# EAGLE design RCV420_RevA (EAGLE 7.4.0)
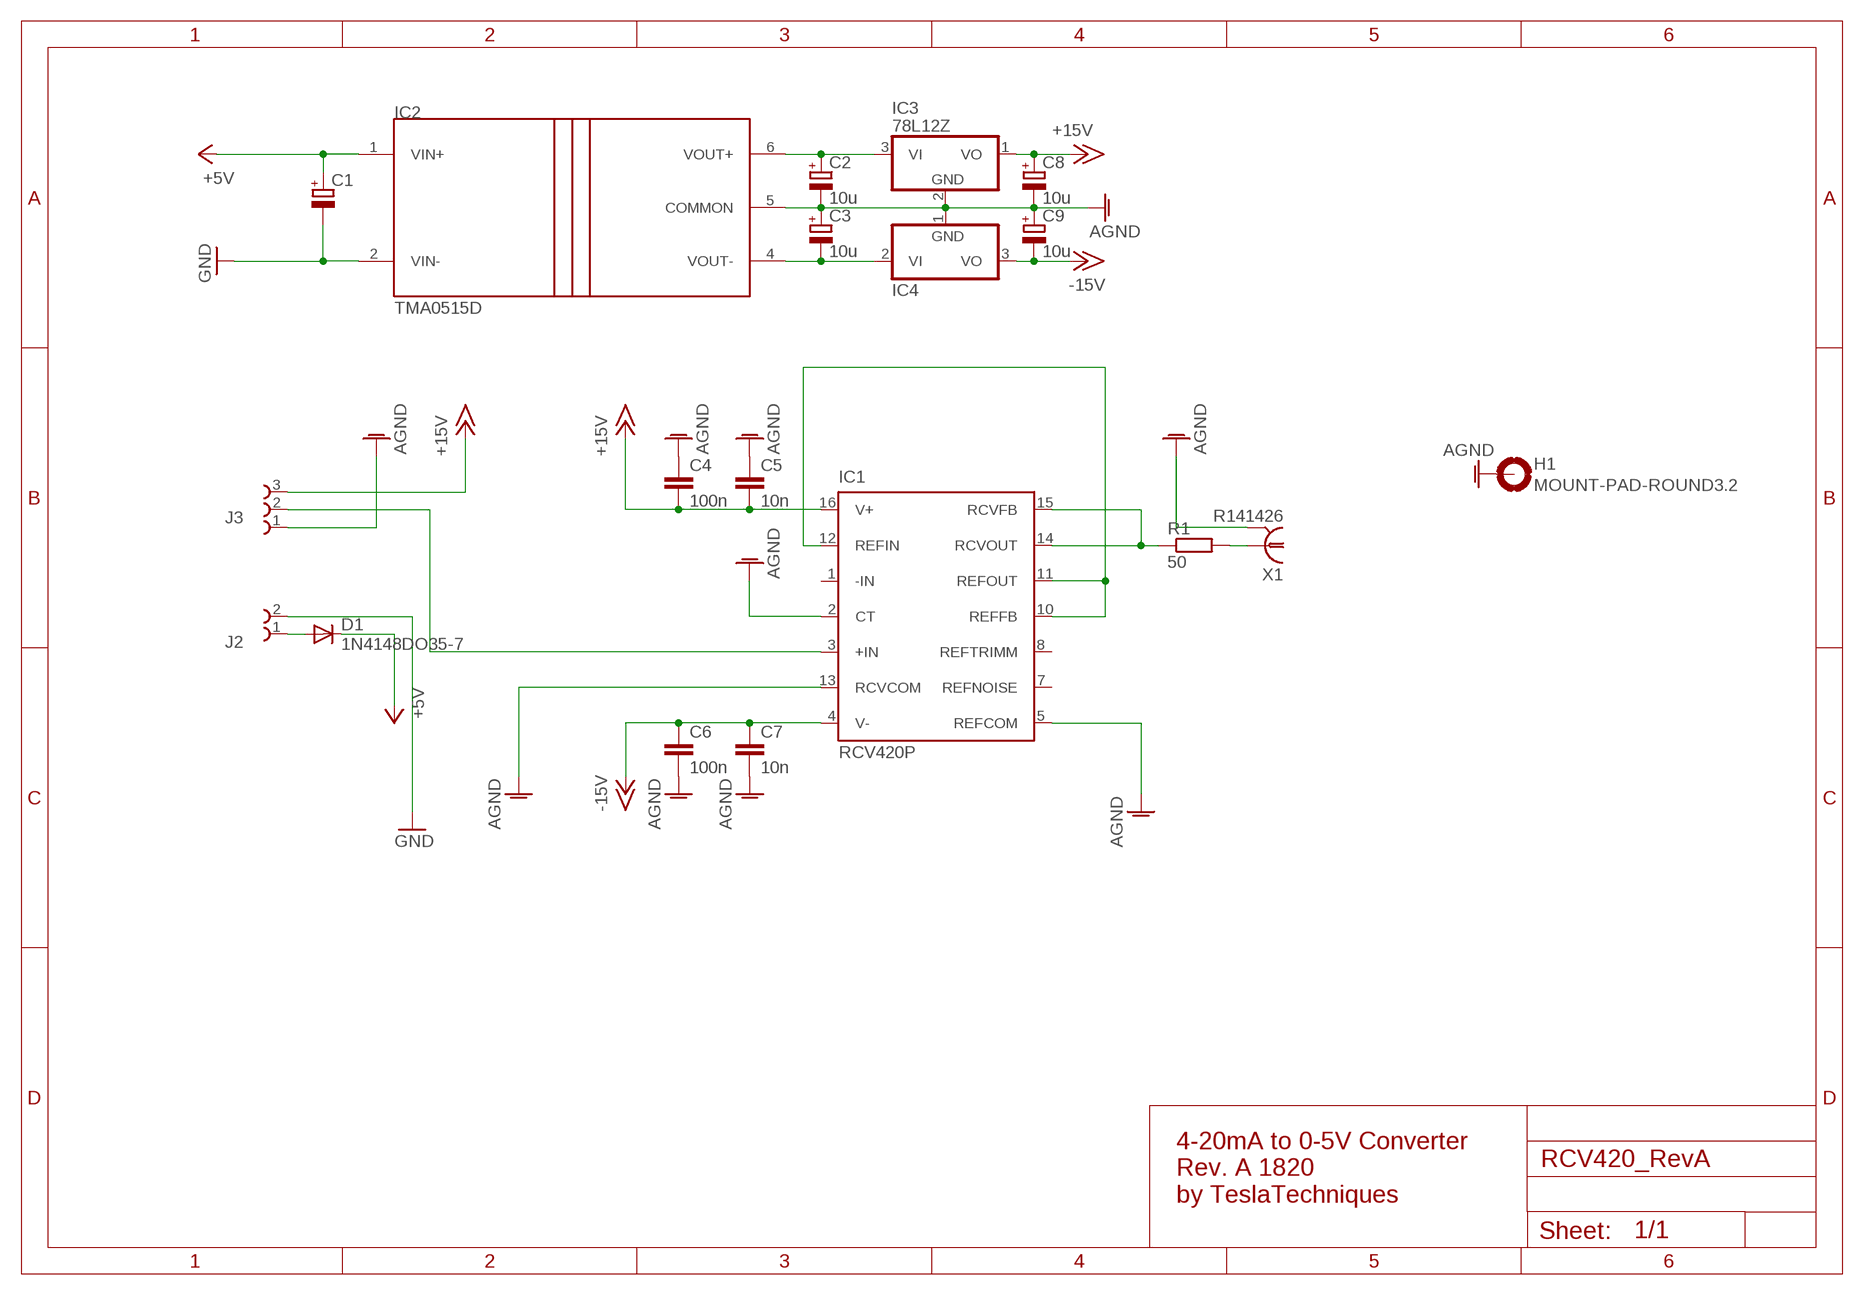
[diagram p0: schematic, sheet 1]

## Parts
C1  CPOL-EUE2.5-5  [E2,5-5]
C2  10u  CPOL-EUE2.5-5  [E2,5-5]
C3  10u  CPOL-EUE2.5-5  [E2,5-5]
C4  100n  C-EU025-025X050  [C025-025X050]
C5  10n  C-EU025-025X050  [C025-025X050]
C6  100n  C-EU025-025X050  [C025-025X050]
C7  10n  C-EU025-025X050  [C025-025X050]
C8  10u  CPOL-EUE2.5-5  [E2,5-5]
C9  10u  CPOL-EUE2.5-5  [E2,5-5]
D1  1N4148DO35-7  [DO35-7]
H1  MOUNT-PAD-ROUND3.2  [3,2-PAD]
IC1  RCV420P  [DIL16]
IC2  TMA0515D  [SIP7]
IC3  78L12Z  [TO92]
IC4  7912L  [TO92]
J2  691111710002  [691111710002]
J3  691111710003  [691111710003]
R1  50  R-EU_0411/12  [0411/12]
X1  R141426  [R141426]

## Nets
+5V: C1.+ D1.C IC2.1(VIN+)
+15V: C4.2 C5.2 C8.+ IC1.16(V+) IC3.1(VO) J3.3
-15V: C6.1 C7.1 C9.- IC1.4(V-) IC4.3(VO)
AGND: C2.- C3.+ C4.1 C5.1 C6.2 C7.2 C8.- C9.+ H1.B3,2(MOUNT) IC1.2(CT) IC1.5(REFCOM) IC1.13(RCVCOM) IC2.5(COMMON) IC3.2(GND) IC4.1(GND) J3.1 X1.2 X1.3 X1.4 X1.5
GND: C1.- IC2.2(VIN-) J2.2
N$1: IC1.3(+IN) J3.2
N$2: C2.+ IC2.6(VOUT+) IC3.3(VI)
N$3: C3.- IC2.4(VOUT-) IC4.2(VI)
N$4: D1.A J2.1
N$9: IC1.14(RCVOUT) IC1.15(RCVFB) R1.1
N$11: IC1.10(REFFB) IC1.11(REFOUT) IC1.12(REFIN)
N$13: R1.2 X1.1
Unconnected: IC1.1(-IN) IC1.7(REFNOISE) IC1.8(REFTRIMM)

## Notes on the sheet
- 4-20mA to 0-5V Converter
  Rev. A 1820
  by TeslaTechniques

## Library data of the parts
C1-C3 C8 C9 = rcl:CPOL-EU: POLARIZED CAPACITOR, European symbol
C4-C7 = rcl:C-EU: CAPACITOR, European symbol
D1 = diode:1N4148: DIODE high speed (Philips)
H1 = holes:MOUNT-PAD-ROUND: MOUNTING PAD, round
IC1 = burr-brown:RCV420: Precision 4mA to 20mA CURRENT LOOP RECEIVER Source: http://focus.ti.com/lit/ds/symlink/rcv420.pdf; MF: TEXAS INSTRUMENTS; MPN: RCV420JP; OC_FARNELL: 1212342; OC_NEWARK: 60K6765
IC2 = traco_tma:TMA: Traco Power TMA Series DC/DC Converter
IC3 = linear:78*: Positive VOLTAGE REGULATOR Source: http://cache.national.com/ds/LM/LM78L05.pdf http://www.fairchildsemi.com/ds/LM/LM7805.pdf
IC4 = linear:79*: Negative VOLTAGE REGULATOR
J2 = EAGLE-TERMINAL_BLOCKS-rev16e:691111710002: WR-TBL Serie 111 - 5.0mm Horizontal Entry Modular With Pressure Clamp - 2.0mm2 Wires, 2 Pins=>Code : Con_TBL_Screw_PressureClamp_691111710002 <http://katalog.we-online.de/media/images/eican/Con_TBL_Screw_PressureClamp_6911117100xx_pf2.jpg> Details see: http://katalog.we-online.de/en/em/691_111_710_0xx Created 2014-06-17, Karrer Zheng 2014 (C) Würth Elektronik
J3 = EAGLE-TERMINAL_BLOCKS-rev16e:691111710003: WR-TBL Serie 111 - 5.0mm Horizontal Entry Modular With Pressure Clamp - 2.0mm2 Wires, 3 Pins=>Code : Con_TBL_Screw_PressureClamp_691111710003 <http://katalog.we-online.de/media/images/eican/Con_TBL_Screw_PressureClamp_6911117100xx_pf2.jpg> Details see: http://katalog.we-online.de/en/em/691_111_710_0xx Created 2014-06-17, Karrer Zheng 2014 (C) Würth Elektronik
R1 = rcl:R-EU_: RESISTOR, European symbol
X1 = con-coax:R141426: BNC COAX CONNECTOR Radiall 50/75 Ohm Spoerle; MF: FARNELL; MPN: R141426161; OC_FARNELL: 4195115; OC_NEWARK: 14J7919

## Board
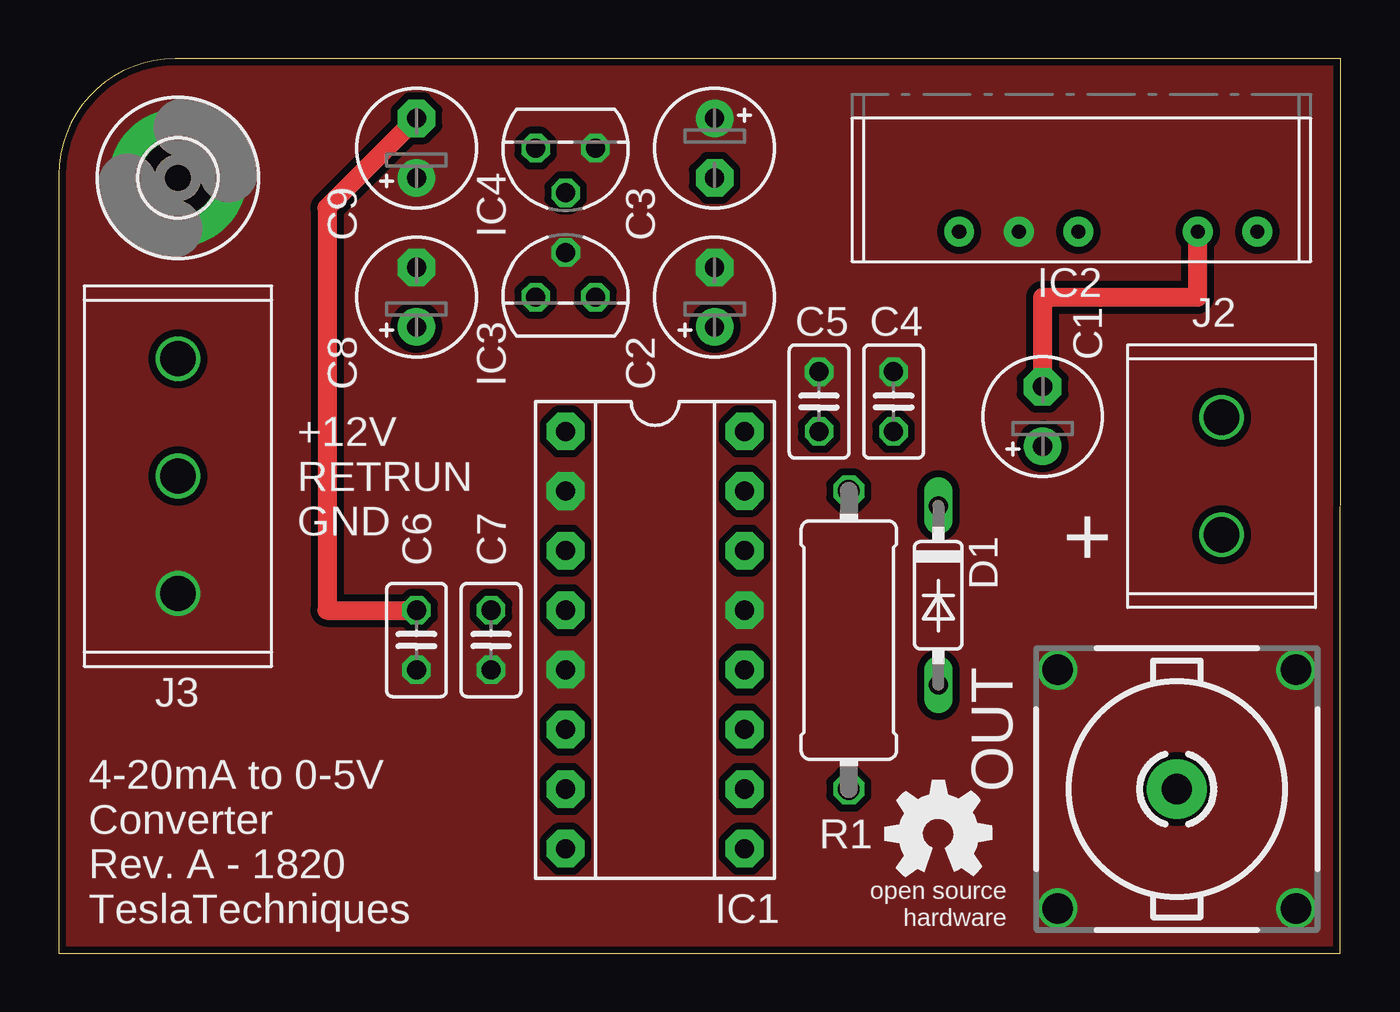
[diagram p1: board, top side]
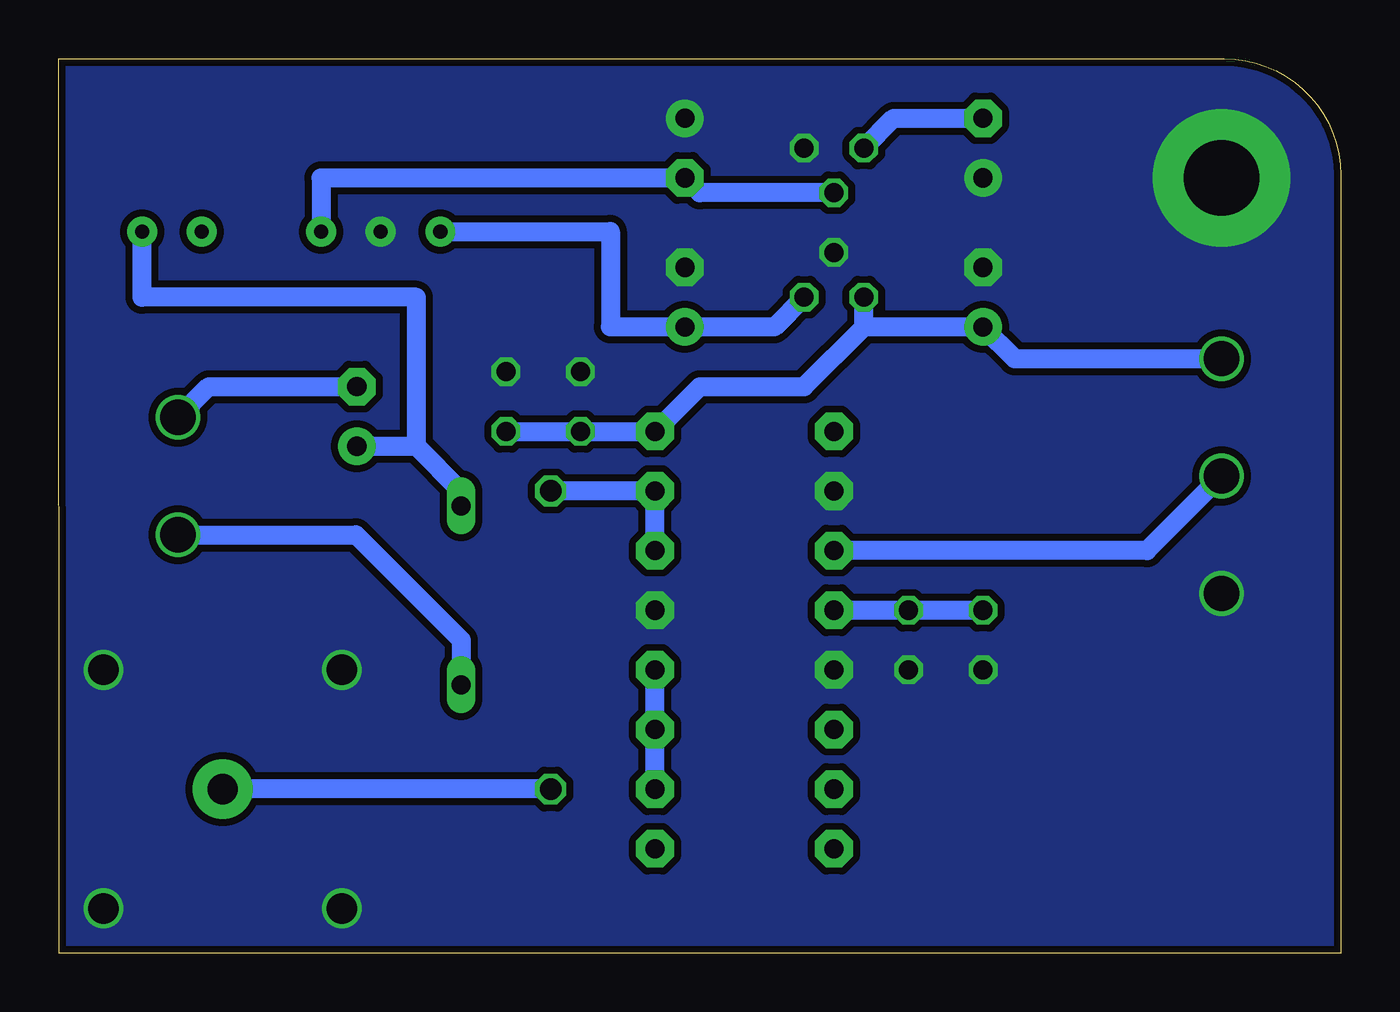
[diagram p2: board, bottom side, seen from below]

Size 54.61 x 38.1 mm. Coordinates in mm from the lower left corner, seen from the top.
Outline: 0,0 54.59,0 54.61,38.1 4.96,38.1 arc90 0,33.14 0,0
Copper layers (1*16): Top 0.035mm / dielectric 1.5mm / Bottom 0.035mm
Design rules "PCB-POOL Standard *": minimum track width 0.15mm, minimum drill 0.3mm, track to track 0.3mm, track to pad 0.3mm, pad to pad 0.3mm, via to via 0.3mm, smd to smd 0.3mm, copper to edge 0.3mm, drill to drill 0.2mm, minimum pad ring 0.2mm, minimum via ring 0.15mm, stop-mask expansion 0.075mm, vias tented up to drill 0mil, thermal gap 0.2mm

### Footprints (pad centres in the part's own frame; a part is rotated, then mirrored left to right if it is on the bottom)
E2,5-5 = drill 0.813 pad 1.6: + -1.27,0 | drill 0.813 pad 1.6 octagon: - 1.27,0
C025-025X050 = drill 0.813 octagon: 1 -1.27,0; 2 1.27,0
DO35-7 = drill 0.813 long: A 3.81,0; C -3.81,0
3,2-PAD = drill 3.2 pad 5.842: B3,2 0,0
DIL16 = drill 0.813 pad 1.6 octagon: 1 -8.89,-3.81; 2 -6.35,-3.81; 3 -3.81,-3.81; 4 -1.27,-3.81; 5 1.27,-3.81; 6 3.81,-3.81; 7 6.35,-3.81; 8 8.89,-3.81; 9 8.89,3.81; 10 6.35,3.81; 11 3.81,3.81; 12 1.27,3.81; 13 -1.27,3.81; 14 -3.81,3.81; 15 -6.35,3.81; 16 -8.89,3.81
SIP7 = drill 0.6 pad 1.27: 1 -7.874,2.286; 2 -5.334,2.286; 4 -0.254,2.286; 5 2.286,2.286; 6 4.826,2.286
TO92 = drill 0.813 octagon: 1 -1.27,0; 2 0,1.905; 3 1.27,0
691111710002 = drill 1.5: 1 -2.5,0; 2 2.5,0
691111710003 = drill 1.5: 1 -5,0; 2 0,0; 3 5,0
0411/12 = drill 0.914 octagon: 1 -6.35,0; 2 6.35,0
R141426 = drill 1.295 pad 2.54: 1 0,0 | drill 1.295: 2 5.08,5.08; 3 -5.08,5.08; 4 -5.08,-5.08; 5 5.08,-5.08

### Placement (x,y rotation side)
C1  41.91,22.86 90 top
C2  27.94,27.94 90 top
C3  27.94,34.29 270 top
C4  35.56,23.5 270 top
C5  32.38,23.5 270 top
C6  15.24,13.34 270 top
C7  18.41,13.34 270 top
C8  15.24,27.94 90 top
C9  15.24,34.29 90 top
D1  37.47,15.24 270 top
H1  5.08,33.02 0 top
IC1  25.4,13.34 270 top
IC2  43.18,33.02 180 top
IC3  21.59,27.94 0 top
IC4  21.59,34.29 180 top
J2  49.53,20.32 90 top
J3  5.08,20.32 90 top
R1  33.66,13.34 270 top
U$1  [OSHW_5MM]  37.47,5.08 0 top
X1  47.62,6.99 90 top

### Tracks (layer width: path | path; a pad name or v marks a point on that pad's centre or on a via)
+5V
  Bottom 0.813: C1.+ 39.37,21.59 | 39.37,21.59 39.37,27.94 51.05,27.94 IC2.1 | D1.C 37.47,19.68 39.37,21.59
+15V
  Bottom 0.813: 20.32,26.67 C8.+ 13.89,25.32 J3.3 | C4.2 C5.2 IC1.16 27.3,24.13 22.86,24.13 20.32,26.67 | 20.32,26.67 IC3.1
-15V
  Top 0.813: C9.- 11.43,31.75 11.43,14.61 C6.1
  Bottom 0.813: C6.1 C7.1 IC1.4 | IC4.3 19.05,35.56 C9.-
AGND
  pour Bottom (no thermals): 0,0 54.61,0 54.61,38.1 0,38.1
  pour Top (no thermals): 0,0 54.61,0 54.61,38.1 0,38.1
GND
  Top 0.813: C1.- 41.91,27.94 48.51,27.94 IC2.2
  Bottom 0.813: J2.2 48.22,24.13 C1.-
N$1
  Bottom 0.813: IC1.3 8.26,17.14 J3.2
N$2
  Bottom 0.813: IC3.3 24.13,26.67 C2.+ 31.11,26.67 31.11,30.73 IC2.6
N$3
  Bottom 0.813: IC4.2 27.3,32.38 C3.- 43.43,33.02 IC2.4
N$4
  Bottom 0.813: J2.1 41.95,17.82 37.47,13.34 D1.A
N$9
  Bottom 0.813: IC1.14 IC1.15 R1.1
N$11
  Bottom 0.813: IC1.10 IC1.11 IC1.12
N$13
  Bottom 0.813: R1.2 X1.1

### Text on the board
tPlace: +12V / RETRUN / GND | + | OUT | 4-20mA to 0-5V / Converter / Rev. A - 1820 / TeslaTechniques